# EAGLE design Obstacle Avoider (EAGLE 9.5.0)
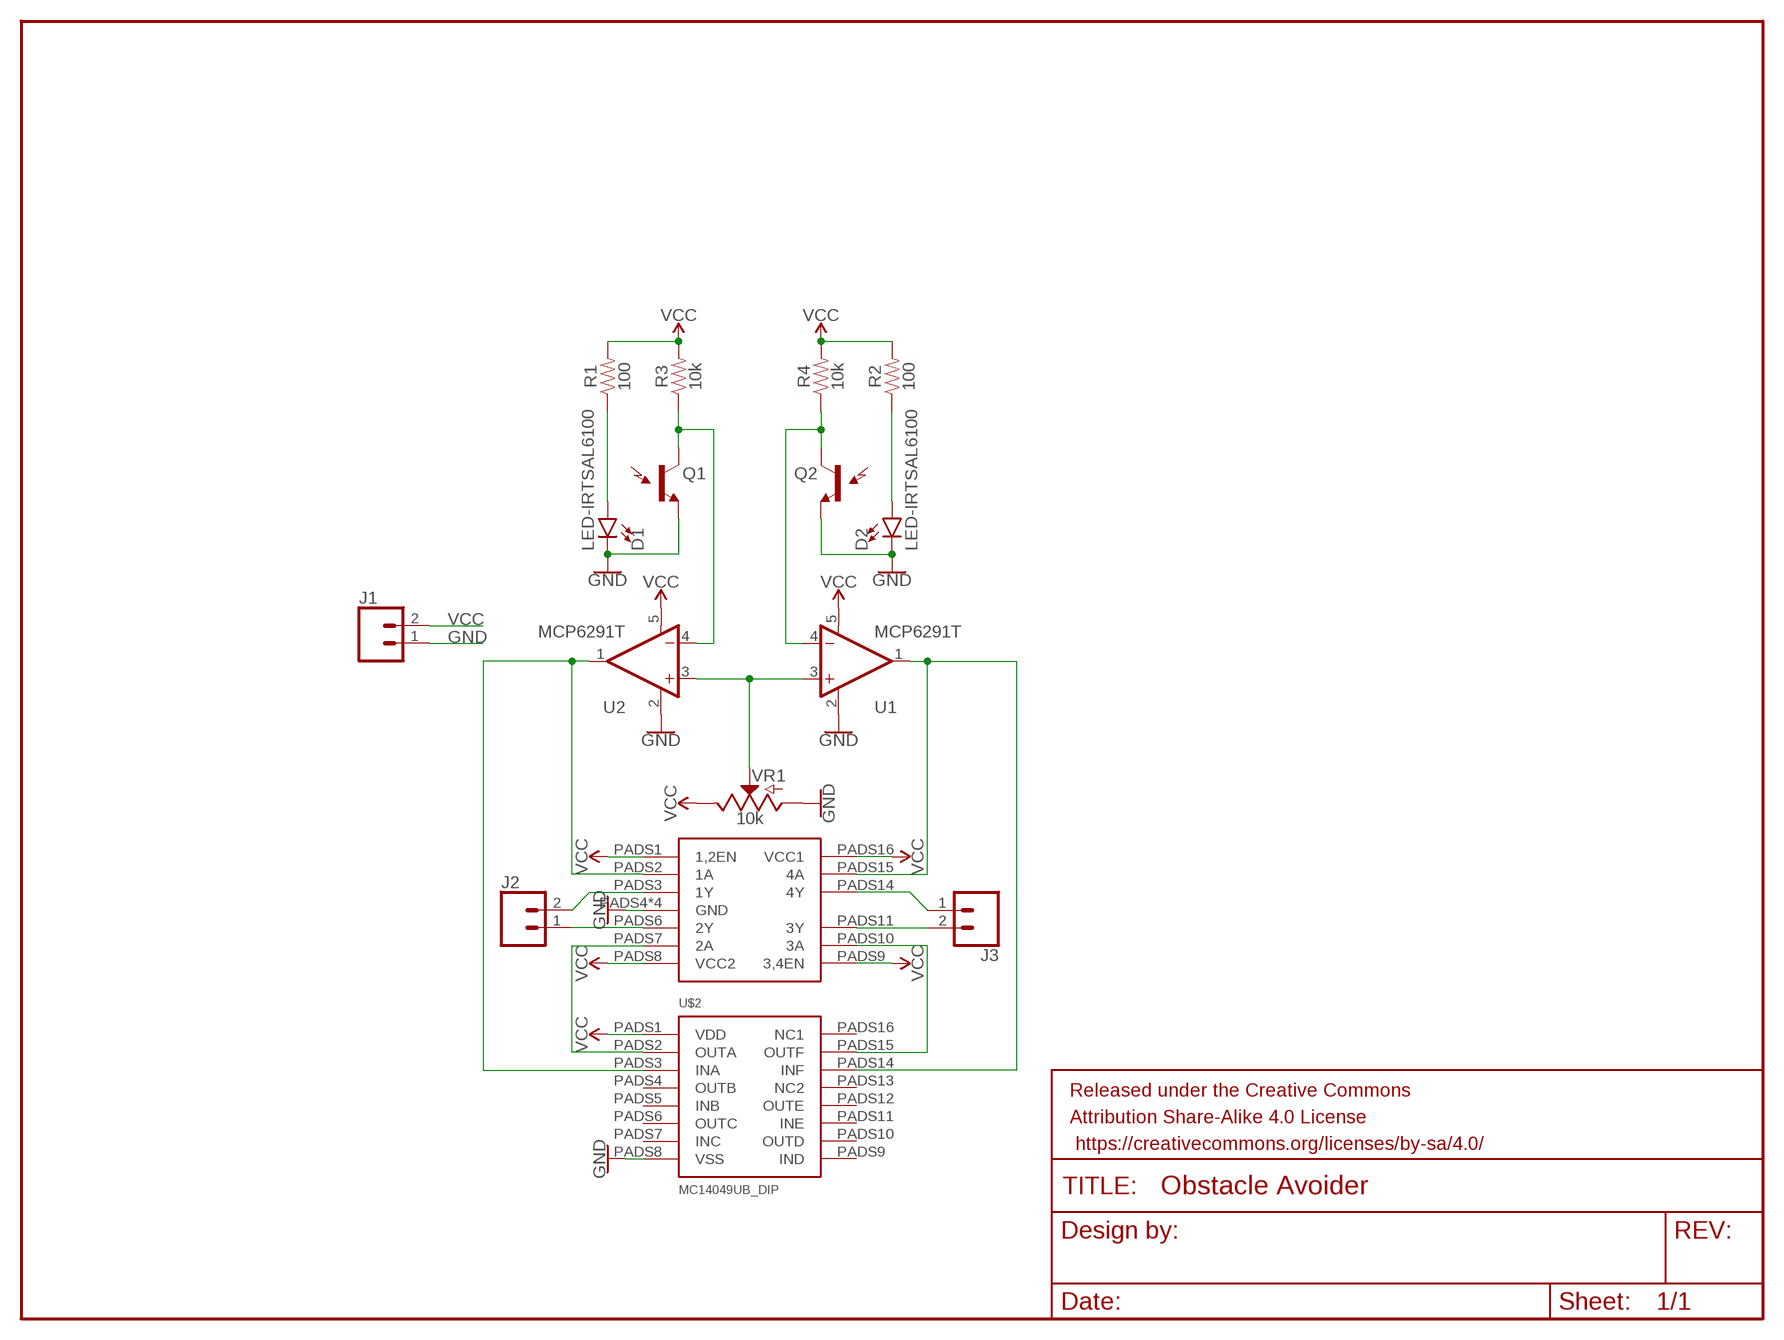
[diagram p0: schematic, sheet 1]

## Parts
D1  LED-IRTSAL6100  [LED_5MM]
D2  LED-IRTSAL6100  [LED_5MM]
FRAME1  FRAME-LETTER  [CREATIVE_COMMONS]
J1  CONN_02  [1X02]
J2  CONN_02  [1X02]
J3  CONN_02  [1X02]
Q1  LTR-301  [LTR-301]
Q2  LTR-301  [LTR-301]
R1  100  100OHM-HORIZ-1/4W-1%  [AXIAL-0.3]
R2  100  100OHM-HORIZ-1/4W-1%  [AXIAL-0.3]
R3  10k  10KOHM-HORIZ-1/4W-1%  [AXIAL-0.3]
R4  10k  10KOHM-HORIZ-1/4W-1%  [AXIAL-0.3]
U1  MCP6291T  MCP6291T-E/OT  [SOT23-5]
U2  MCP6291T  MCP6291T-E/OT  [SOT23-5]
U$1  L293DNE  [L293DNE]
U$2  MC14049UB_DIP  [MC14049UB_DIP]
VR1  10k  POTENTIOMETER-PTH-9MM-1/20W-20%-KIT  [POT-PTH-ALPS-KIT]

## Nets
GND: D1.K(C) D2.K(C) J1.1 Q1.E(E1) Q2.E(E1) U1.2(V-) U2.2(V-) U$1.PADS4(GND) U$1.PADS5(GND) U$1.PADS12(GND) U$1.PADS13(GND) U$2.PADS8(VSS) VR1.P$3(A)
N$1: D1.A R1.P$1
N$2: D2.A R2.P$1
N$3: U2.1(OUT) U$1.PADS2(1A) U$2.PADS3(INA)
N$4: Q2.C(C1) R4.P$1 U1.4(-IN)
N$5: U1.3(+IN) U2.3(+IN) VR1.P$2(S)
N$6: Q1.C(C1) R3.P$1 U2.4(-IN)
N$7: U1.1(OUT) U$1.PADS15(4A) U$2.PADS14(INF)
N$8: U$1.PADS10(3A) U$2.PADS15(OUTF)
N$9: J2.1 U$1.PADS6(2Y)
N$10: U$1.PADS7(2A) U$2.PADS2(OUTA)
N$11: J2.2 U$1.PADS3(1Y)
N$12: J3.2 U$1.PADS11(3Y)
N$13: J3.1 U$1.PADS14(4Y)
VCC: J1.2 R1.P$2 R2.P$2 R3.P$2 R4.P$2 U1.5(V+) U2.5(V+) U$1.PADS1(1,2EN) U$1.PADS8(VCC2) U$1.PADS9(3,4EN) U$1.PADS16(VCC1) U$2.PADS1(VDD) VR1.P$1(E)
Unconnected: U$2.PADS4(OUTB) U$2.PADS5(INB) U$2.PADS6(OUTC) U$2.PADS7(INC) U$2.PADS9(IND) U$2.PADS10(OUTD) U$2.PADS11(INE) U$2.PADS12(OUTE) U$2.PADS13(NC2) U$2.PADS16(NC1)

## Library data of the parts
D1 D2 = SparkFun-LED:LED-IR: Infrared LED (IR) Wavelength: 940nm Packages: TSAL6100 LTE302 - Side firing. Check SparkFun-Sensors.lbr for the receiver SparkFun Products: ZX Distance and Gesture Sensor <[https://www.sparkfun.com/products/12780]> Infrared Emitters and Detectors <https://www.sparkfun.com/products/241>; PROD_ID: DIO-12058
FRAME1 = SparkFun-Aesthetics:FRAME-LETTER: Schematic Frame - Letter Standard 8.5x11 US Letter frame
J1-J3 = SparkFun-Connectors:CONN_02: Multi connection point. Often used as Generic Header-pin footprint for 0.1 inch spaced/style header connections On any of the 0.1 inch spaced packages, you can populate with these: Break Away Headers - Straight <https://www.sparkfun.com/products/116> (PRT-00116) Break Away Male Headers - Right Angle <https://www.sparkfun.com/products/553> (PRT-00553) Female Headers <https://www.sparkfun.com/products/115> (PRT-00115) Break Away Headers - Machine Pin <https://www.sparkfun.com/products/117> (PRT-00117) Break Away Female Headers - Swiss Machine Pin <https://www.sparkfun.com/products/743> (PRT-00743) For SCREWTERMINALS and SPRING TERMINALS visit here: Screw Terimnals on SparkFun.com <https://www.sparkfun.com/search/results?term=Screw+Terminals> (5mm/3.5mm/2.54mm spacing) This device is also useful as a general connection point to wire up your design to another part of your project. Our various solder wires solder well into these plated through hole pads. Hook-Up Wire - Assortment (Stranded, 22 AWG) <https://www.sparkfun.com/products/11375> (PRT-11375) Hook-Up Wire - Assortment (Solid Core, 22 AWG) <https://www.sparkfun.com/products/11367> (PRT-11367) View the entire wire category on our website here <https://www.sparkfun.com/categories/141> Special notes: Molex polarized connector foot print use with: PRT-08233 with associated crimp pins and housings. 2.54_SCREWTERM for use with PRT-10571. 3.5mm Screw Terminal footprints for PRT-08084 5mm Screw Terminal footprints for use with PRT-08432
Q1 Q2 = SparkFun-Sensors:LTR-301: LiteOn LTR-301 IR Phototransistor (Side-Receiving) Side-looking Infrared detectors. These simple devices operate at 940nm and work well for generic IR systems including remote control and touch-less object sensing. Using a simple ADC on any microcontroller will allow variable readings to be collected from the detector. Datasheet <http://www.sparkfun.com/datasheets/Components/LTR-301.pdf> SparkFun Products Infrared Emitters and Detectors <https://www.sparkfun.com/products/241> (SEN-00241); PROD_ID: DIO-10904; SF_ID: SEN-00241
R1 R2 = SparkFun-Resistors:100OHM: 100Ω resistor A resistor is a passive two-terminal electrical component that implements electrical resistance as a circuit element. Resistors act to reduce current flow, and, at the same time, act to lower voltage levels within circuits. - Wikipedia; PROD_ID: RES-12181
R3 R4 = SparkFun-Resistors:10KOHM: 10kΩ resistor A resistor is a passive two-terminal electrical component that implements electrical resistance as a circuit element. Resistors act to reduce current flow, and, at the same time, act to lower voltage levels within circuits. - Wikipedia; PROD_ID: RES-12183
U1 U2 = SparkFun-Retired:MCP6291: Rail to rail OpAmp with 10MHz GBP Prototype: IC-11991; PROD_ID: IC-11991
U$1 = crazyCar:L293DNE
U$2 = crazyCar:MC14049UB_DIP: This is the inverter used for the Crazzy Robot Car.
VR1 = SparkFun-Resistors:POTENTIOMETER: Potentiometer (Pot) Three-terminal potentiometers, with an adjustable wiper and two adjustable resistors. A pot can be used to create a configurable voltage divider, or as a variable resistor. Variants ALPS_POT and ALPS_POT_KIT - PTH, breadboard compatible, 9mm square pots Rotary Potentiometer - Linear (10k ohm) <https://www.sparkfun.com/products/9288> (COM-09288) The KIT variant exposes copper on only one side of the PTH pad, so the part can only be assembled on one side of the PCB. Useful for beginner soldering kits.; PROD_ID: RES-09177; SF_SKU: COM-09288

## Board
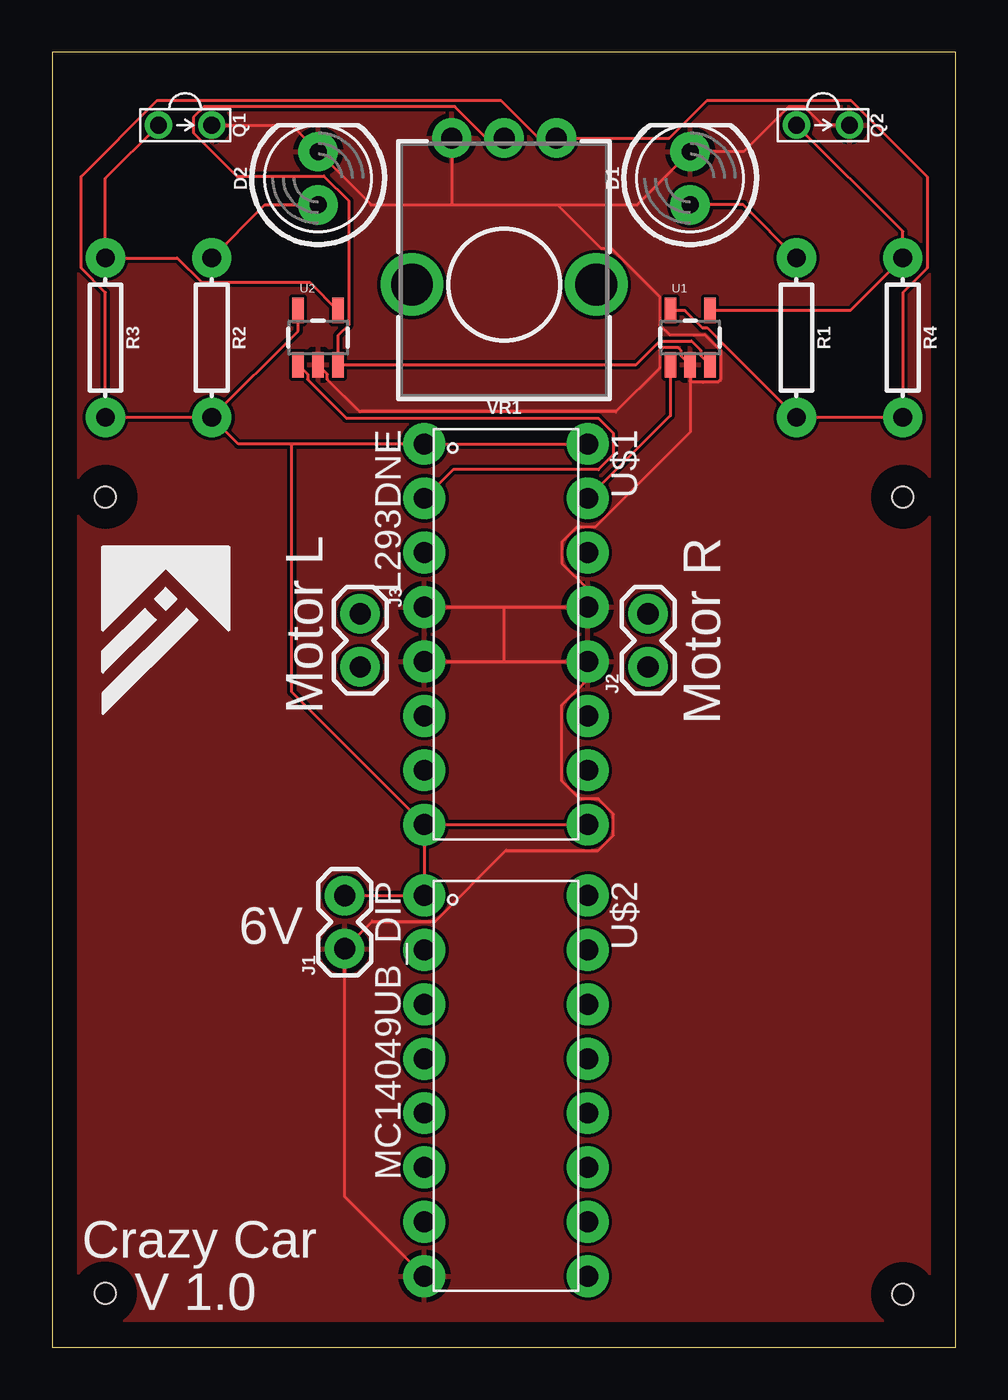
[diagram p1: board, top side]
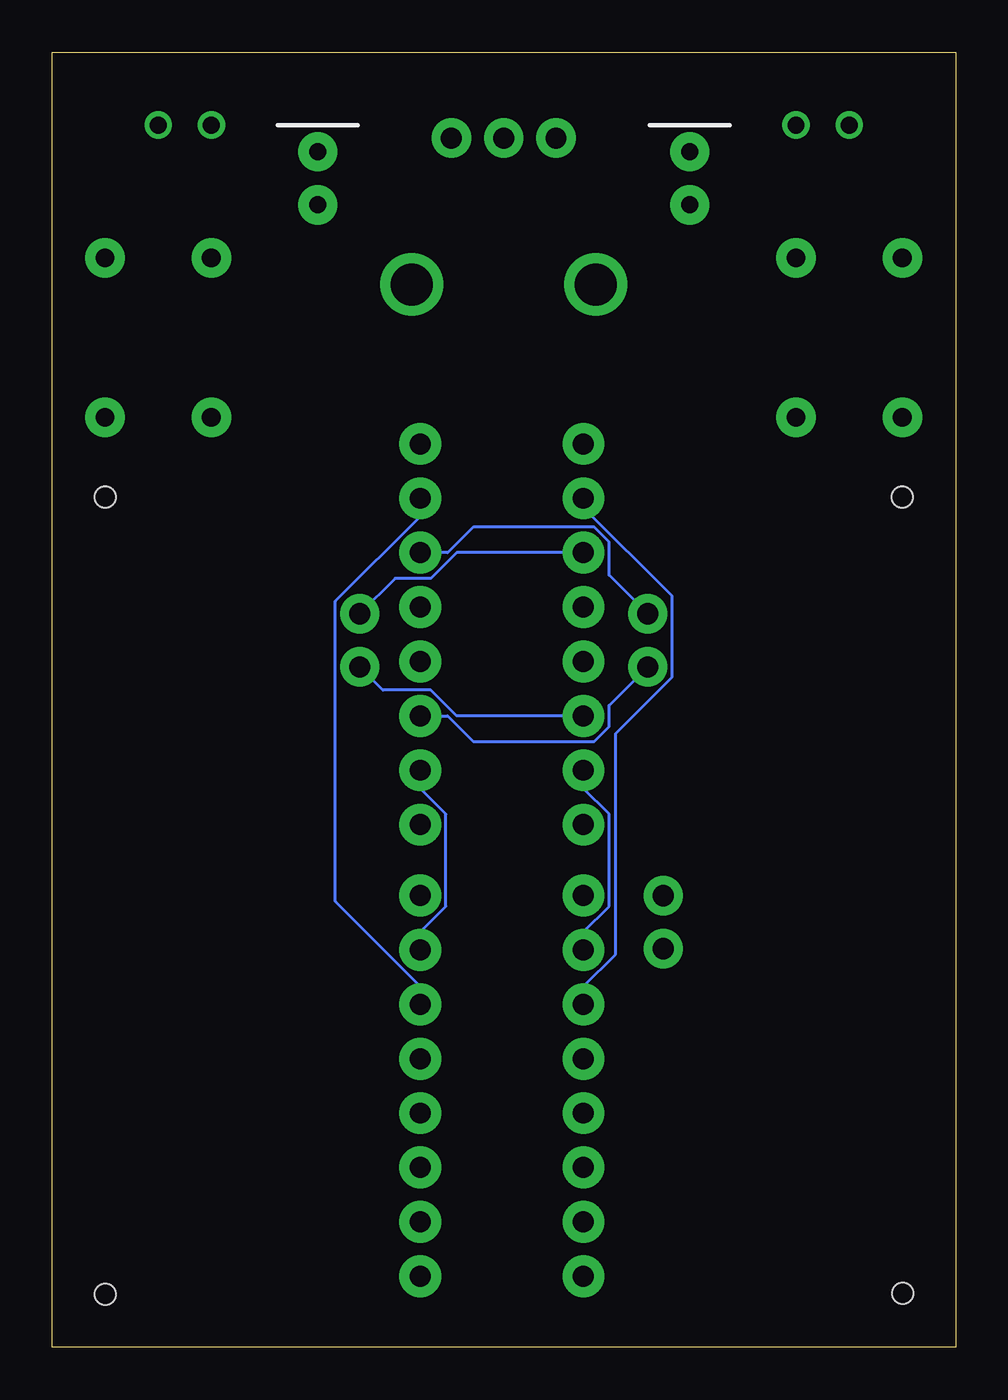
[diagram p2: board, bottom side, seen from below]

Size 43.16 x 61.9 mm. Coordinates in mm from the lower left corner, seen from the top.
Outline: 0,0 43.16,0 43.16,61.9 0,61.9 0,0
Copper layers (1*16): Top 0.035mm / dielectric 1.5mm / Bottom 0.035mm
Design rules "default": minimum track width 6mil, minimum drill 0.35mm, track to track 6mil, track to pad 6mil, pad to pad 6mil, via to via 6mil, smd to smd 6mil, copper to edge 40mil, drill to drill 6mil, minimum pad ring 10mil, minimum via ring 8mil, stop-mask expansion 4mil, vias tented up to drill 0mil, thermal gap 10mil
Holes 1 mm at 2.54,40.64 40.64,40.64 40.64,2.54 2.52,2.57

### Footprints (pad centres in the part's own frame; a part is rotated, then mirrored left to right if it is on the bottom)
LED_5MM = drill 0.813 pad 1.88: A -1.27,0; K 1.27,0
1X02 = drill 1.016 pad 1.88: 1 0,0; 2 2.54,0
LTR-301 = drill 0.8: C 1.27,0; E -1.27,0
AXIAL-0.3 = drill 0.9 pad 1.88: P$1 -3.81,0; P$2 3.81,0
SOT23-5 = smd 0.55 x 1.2: 1 -0.95,-1.3; 2 0,-1.3; 3 0.95,-1.3; 4 0.95,1.3; 5 -0.95,1.3
L293DNE = drill 1 pad 2: PADS1 0,0; PADS2 2.6,0; PADS3 5.2,0; PADS4 7.8,0; PADS5 10.4,0; PADS6 13,0; PADS7 15.6,0; PADS8 18.2,0; PADS9 18.2,7.8; PADS10 15.6,7.8; PADS11 13,7.8; PADS12 10.4,7.8; PADS13 7.8,7.8; PADS14 5.2,7.8; PADS15 2.6,7.8; PADS16 0,7.8
MC14049UB_DIP = drill 1 pad 2: PADS1 0,0; PADS2 2.6,0; PADS3 5.2,0; PADS4 7.8,0; PADS5 10.4,0; PADS6 13,0; PADS7 15.6,0; PADS8 18.2,0; PADS9 18.2,7.8; PADS10 15.6,7.8; PADS11 13,7.8; PADS12 10.4,7.8; PADS13 7.8,7.8; PADS14 5.2,7.8; PADS15 2.6,7.8; PADS16 0,7.8
POT-PTH-ALPS-KIT = drill 1 pad 1.88: P$1 7,-2.5; P$2 7,0; P$3 7,2.5 | drill 2: P$4 0,-4.4; P$5 0,4.4

### Placement (x,y rotation side)
D1  30.48,55.88 90 top
D2  12.7,55.88 90 top
FRAME1  -85.09,30.48 0 top  (outside the outline)
J1  13.97,19.05 90 top
J2  28.47,32.52 90 top
J3  14.71,35.06 270 top
Q1  6.35,58.42 180 top
Q2  36.83,58.42 180 top
R1  35.56,48.26 270 top
R2  7.62,48.26 270 top
R3  2.54,48.26 270 top
R4  40.64,48.26 270 top
U1  30.48,48.26 0 top
U2  12.7,48.26 0 top
U$1  17.78,43.18 270 top
U$2  17.78,21.59 270 top
VR1  21.59,50.8 90 top

### Tracks (layer width: path | path; a pad name or v marks a point on that pad's centre or on a via)
GND
  Top 0.152: U$1.PADS4 21.59,35.38 | 21.59,35.38 U$1.PADS13 25.58,36.24 24.35,37.47 24.35,38.49 25.07,39.21 25.95,39.21 30.48,43.74 30.48,46.17 | U$1.PADS5 21.59,32.78 | 21.59,32.78 25.4,32.78 | 25.4,32.78 U$1.PADS12 | 21.59,32.78 21.59,35.38 | Q1.E 11.43,58.42 D2.K 15.24,54.61 19.05,54.61 | Q2.E 36.81,58.42 35.93,59.3 35.19,59.3 33.04,57.15 D1.K 27.94,54.61 24.13,54.61 | 19.05,54.61 24.13,54.61 | VR1.P$3 19.09,54.65 19.05,54.61 | 25.4,32.78 25.4,31.74 24.35,30.69 24.35,27.07 25.21,26.21 26.09,26.21 26.81,25.49 26.81,24.47 26.09,23.75 21.68,23.75 18.29,20.36 15.28,20.36 J1.1 13.97,7.2 U$2.PADS8 | U2.2 13.15,46.51 13.15,46.27 14.7,44.71 26.93,44.71 29.03,46.81 29.03,47.66 29.16,47.79 29.9,47.79 30.03,47.66 30.03,47.41 U1.2 30.48,46.17 | 24.13,54.61 26.21,52.53 26.71,52.53 29.03,50.21 29.03,48.87 29.49,48.4 31.18,48.4 31.79,47.79 31.8,47.79 31.93,47.66 31.93,46.27 31.8,46.13 31.12,46.13 31.06,46.13 30.52,46.13 30.48,46.17
  pour Top: 1.27,1.27 1.27,60.96 41.91,60.96 41.91,1.27
N$1
  Top 0.152: R1.P$1 33.02,54.61 D1.A
N$2
  Top 0.152: R2.P$1 10.16,54.61 D2.A
N$3
  Top 0.152: U2.1 12.2,46.51 12.2,46.27 14.05,44.41 26.09,44.41 26.81,43.69 26.81,42.67 26.09,41.95 19.15,41.95 U$1.PADS2
  Bottom 0.152: U$2.PADS3 17.78,17.25 16.25,18.79 16.25,29.33 13.54,32.04 13.54,35.91 17.78,40.15 U$1.PADS2
N$4
  Top 0.152: Q2.C 40.64,53.34 R4.P$1 38.13,49.56 U1.4
N$5
  Top 0.152: VR1.P$2 20.74,57.8 19.24,59.3 7.25,59.3 6.74,58.79 6.74,58.05 8.81,55.98 12.98,55.98 14.15,54.81 14.15,48.87 13.65,48.36 U2.3 27.9,46.96 29.03,48.09 30.55,48.09 30.98,47.66 30.98,47.41 U1.3
N$6
  Top 0.152: Q1.C 2.54,55.88 R3.P$1 5.97,52.07 7.14,50.9 12.31,50.9 U2.4
N$7
  Top 0.152: U1.1 29.53,44.53 U$1.PADS15
  Bottom 0.152: U$2.PADS14 25.58,17.25 29.64,21.31 29.64,35.66 25.58,39.72 U$1.PADS15
N$8
  Bottom 0.152: U$2.PADS15 25.58,19.85 24.35,21.08 24.35,25.49 25.58,26.72 U$1.PADS10
N$9
  Bottom 0.152: U$1.PADS6 23.84,30.18 25.07,31.41 27.36,31.41 J2.1
N$10
  Bottom 0.152: U$2.PADS2 17.78,19.85 16.55,21.08 16.55,25.49 17.78,26.72 U$1.PADS7
N$11
  Bottom 0.152: U$1.PADS3 23.84,37.98 25.07,36.75 26.78,36.75 J2.2
N$12
  Bottom 0.152: U$1.PADS11 24.27,30.18 23.05,28.95 17.27,28.95 16.55,29.67 16.55,30.68 J3.2
N$13
  Bottom 0.152: U$1.PADS14 24.27,37.98 23.05,39.21 17.27,39.21 16.55,38.49 16.55,36.9 J3.1
VCC
  Top 0.152: R2.P$2 R3.P$2 2.54,50.42 1.37,51.59 1.37,55.96 5.02,59.61 21.44,59.61 23.24,57.8 VR1.P$1 29.48,57.8 31.29,59.61 38.16,59.61 41.81,55.96 41.81,51.59 40.64,50.42 R4.P$2 R1.P$2 32.24,47.77 32.24,47.78 31.29,48.73 31.06,48.73 30.23,49.56 U1.5 | R2.P$2 11.75,48.58 U2.5 | 11.43,43.18 U$1.PADS1 U$1.PADS16 | 11.43,43.18 8.89,43.18 R2.P$2 | U$1.PADS8 U$1.PADS9 | U$1.PADS8 11.43,31.33 11.43,43.18 | J1.2 U$2.PADS1 U$1.PADS8

### Text on the board
tPlace: Motor L | Motor R | 6V | Crazy Car | V 1.0